# EAGLE design brainboard (EAGLE 5.11)

## Sheet 1 of 2
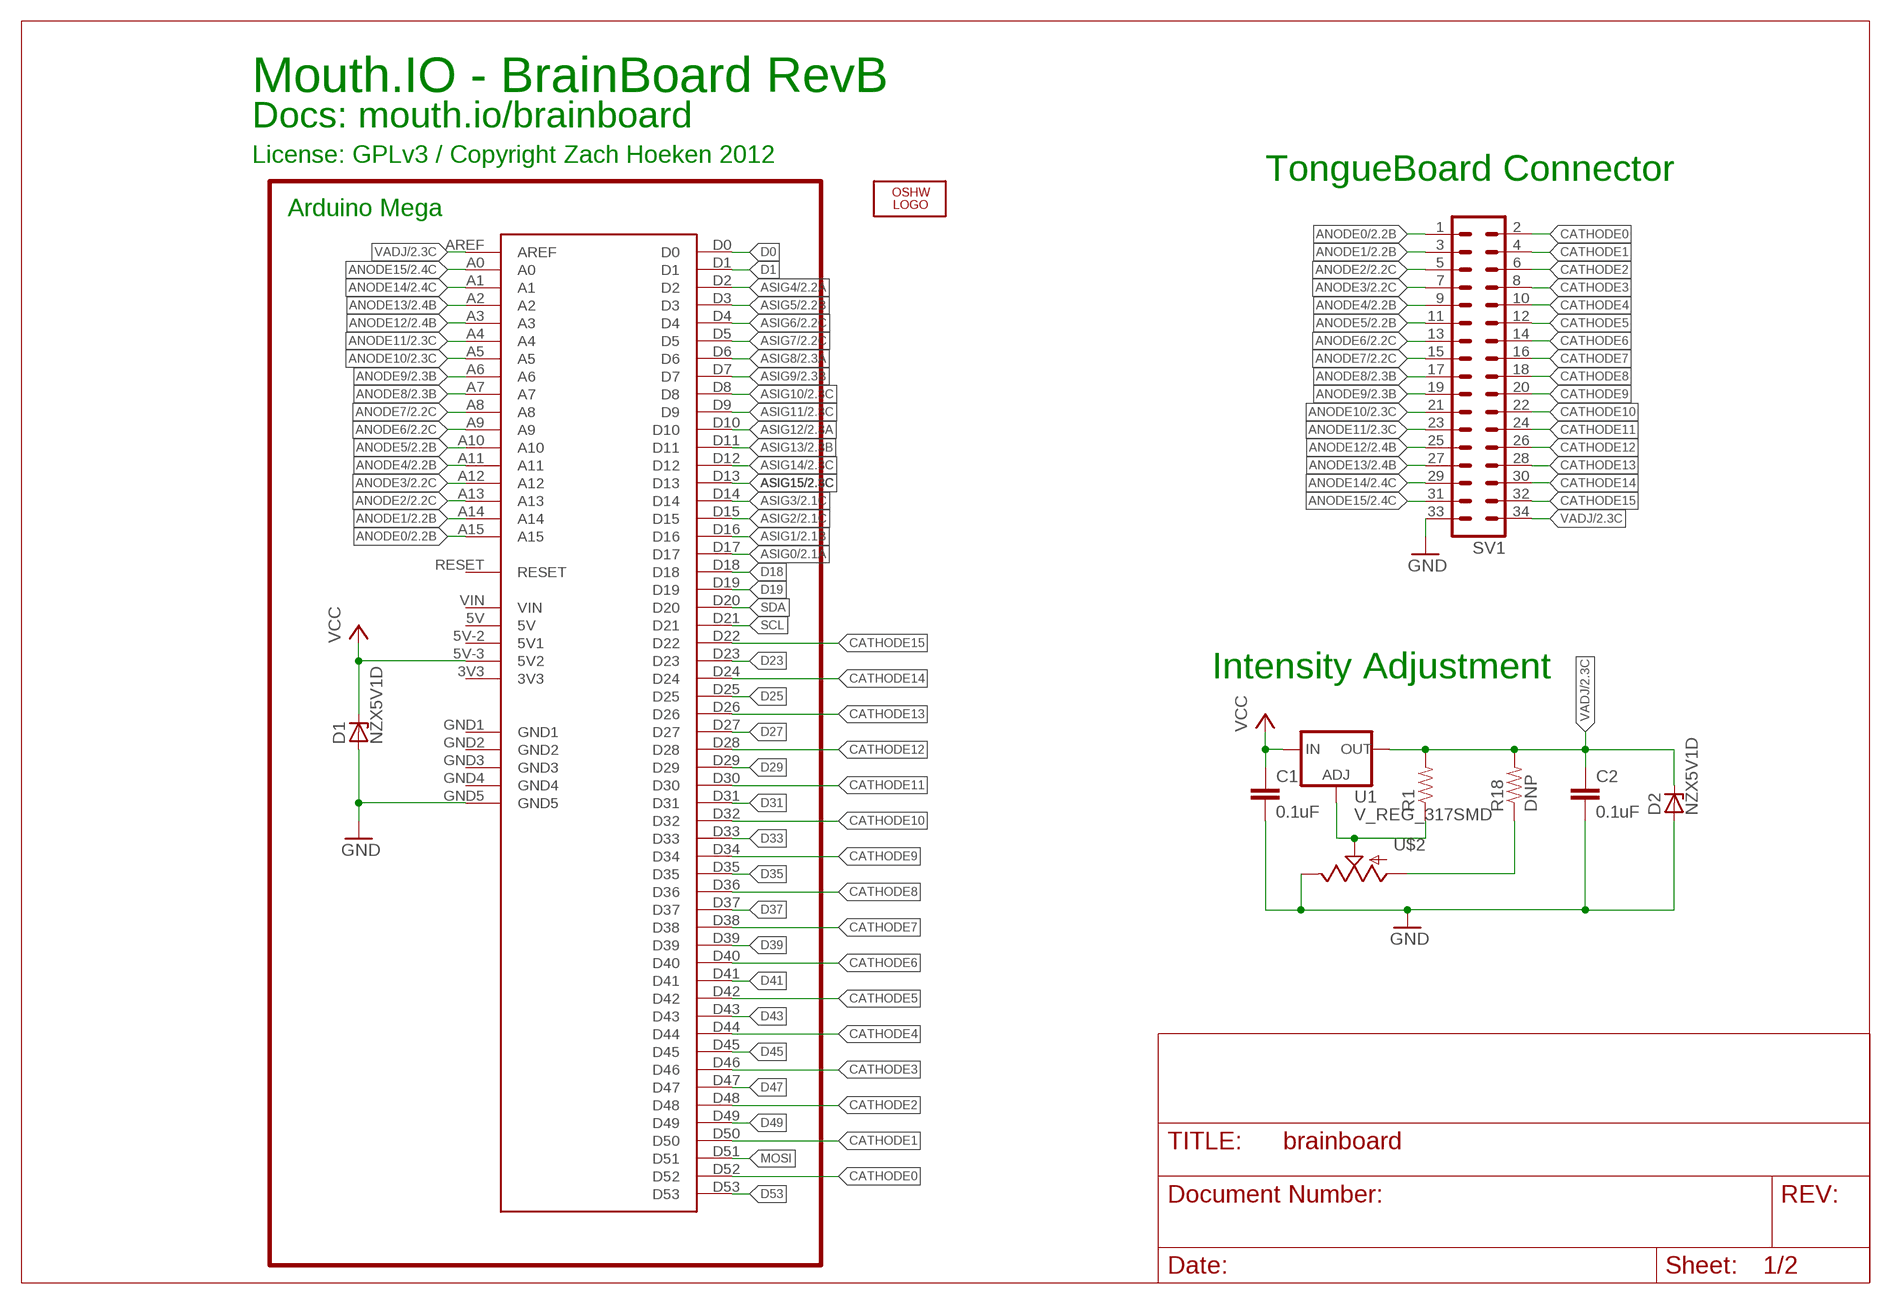
[diagram p0: schematic, sheet 1]

### Parts
C1  0.1uF  CAP0805  [0805]
C2  0.1uF  CAP0805  [0805]
D1  NZX5V1D  ZENER-DIODESOD80C  [SOD80C]
D2  NZX5V1D  ZENER-DIODESOD80C  [SOD80C]
LOGO1  OSHW_LOGO_10MILX0200-NT  [OSHW_10X200_NOTEXT]
R1  RESISTOR  [0805]
R18  DNP  RESISTOR  [0805]
SV1  ML34  [ML34]
U1  V_REG_317SMD  [SOT223]
U$1  ARDUINO-MEGA  [ARDUINO-MEGA]
U$2  POTPTV09A-4  [PTV09A-4]

### Nets
ANODE0: SV1.1 U$1.A15 ; also sheet 2
ANODE1: SV1.3 U$1.A14 ; also sheet 2
ANODE2: SV1.5 U$1.A13 ; also sheet 2
ANODE3: SV1.7 U$1.A12 ; also sheet 2
ANODE4: SV1.9 U$1.A11 ; also sheet 2
ANODE5: SV1.11 U$1.A10 ; also sheet 2
ANODE6: SV1.13 U$1.A9 ; also sheet 2
ANODE7: SV1.15 U$1.A8 ; also sheet 2
ANODE8: SV1.17 U$1.A7 ; also sheet 2
ANODE9: SV1.19 U$1.A6 ; also sheet 2
ANODE10: SV1.21 U$1.A5 ; also sheet 2
ANODE11: SV1.23 U$1.A4 ; also sheet 2
ANODE12: SV1.25 U$1.A3 ; also sheet 2
ANODE13: SV1.27 U$1.A2 ; also sheet 2
ANODE14: SV1.29 U$1.A1 ; also sheet 2
ANODE15: SV1.31 U$1.A0 ; also sheet 2
ASIG0: U$1.D17 ; also sheet 2
ASIG1: U$1.D16 ; also sheet 2
ASIG2: U$1.D15 ; also sheet 2
ASIG3: U$1.D14 ; also sheet 2
ASIG4: U$1.D2 ; also sheet 2
ASIG5: U$1.D3 ; also sheet 2
ASIG6: U$1.D4 ; also sheet 2
ASIG7: U$1.D5 ; also sheet 2
ASIG8: U$1.D6 ; also sheet 2
ASIG9: U$1.D7 ; also sheet 2
ASIG10: U$1.D8 ; also sheet 2
ASIG11: U$1.D9 ; also sheet 2
ASIG12: U$1.D10 ; also sheet 2
ASIG13: U$1.D11 ; also sheet 2
ASIG14: U$1.D12 ; also sheet 2
ASIG15: U$1.D13 ; also sheet 2
CATHODE0: SV1.2 U$1.D52
CATHODE1: SV1.4 U$1.D50
CATHODE2: SV1.6 U$1.D48
CATHODE3: SV1.8 U$1.D46
CATHODE4: SV1.10 U$1.D44
CATHODE5: SV1.12 U$1.D42
CATHODE6: SV1.14 U$1.D40
CATHODE7: SV1.16 U$1.D38
CATHODE8: SV1.18 U$1.D36
CATHODE9: SV1.20 U$1.D34
CATHODE10: SV1.22 U$1.D32
CATHODE11: SV1.24 U$1.D30
CATHODE12: SV1.26 U$1.D28
CATHODE13: SV1.28 U$1.D26
CATHODE14: SV1.30 U$1.D24
CATHODE15: SV1.32 U$1.D22
D0: U$1.D0
D1: U$1.D1
D18: U$1.D18
D19: U$1.D19
D23: U$1.D23
D25: U$1.D25
D27: U$1.D27
D29: U$1.D29
D31: U$1.D31
D33: U$1.D33
D35: U$1.D35
D37: U$1.D37
D39: U$1.D39
D41: U$1.D41
D43: U$1.D43
D45: U$1.D45
D47: U$1.D47
D49: U$1.D49
D53: U$1.D53
GND: C1.2 C2.2 D1.A D2.A SV1.33 U$1.GND5 U$2.1(E)
MOSI: U$1.D51
N$1: R18.1 U$2.3(A)
N$4: R1.1 U1.1(ADJ) U$2.2(S)
SCL: U$1.D21
SDA: U$1.D20
VADJ: C2.1 D2.C R1.2 R18.2 SV1.34 U1.2(OUT) U$1.AREF ; also sheet 2
VCC: C1.1 D1.C U1.3(IN) U$1.5V-3(5V2)
Unconnected: U$1.3V3 U$1.5V U$1.5V-2(5V1) U$1.GND1 U$1.GND2 U$1.GND3 U$1.GND4 U$1.RESET U$1.VIN

### Notes on the sheet
- Mouth.IO - BrainBoard RevB
- Docs: mouth.io/brainboard
- License: GPLv3 / Copyright Zach Hoeken 2012
- TongueBoard Connector
- Arduino Mega
- Intensity Adjustment

## Sheet 2 of 2
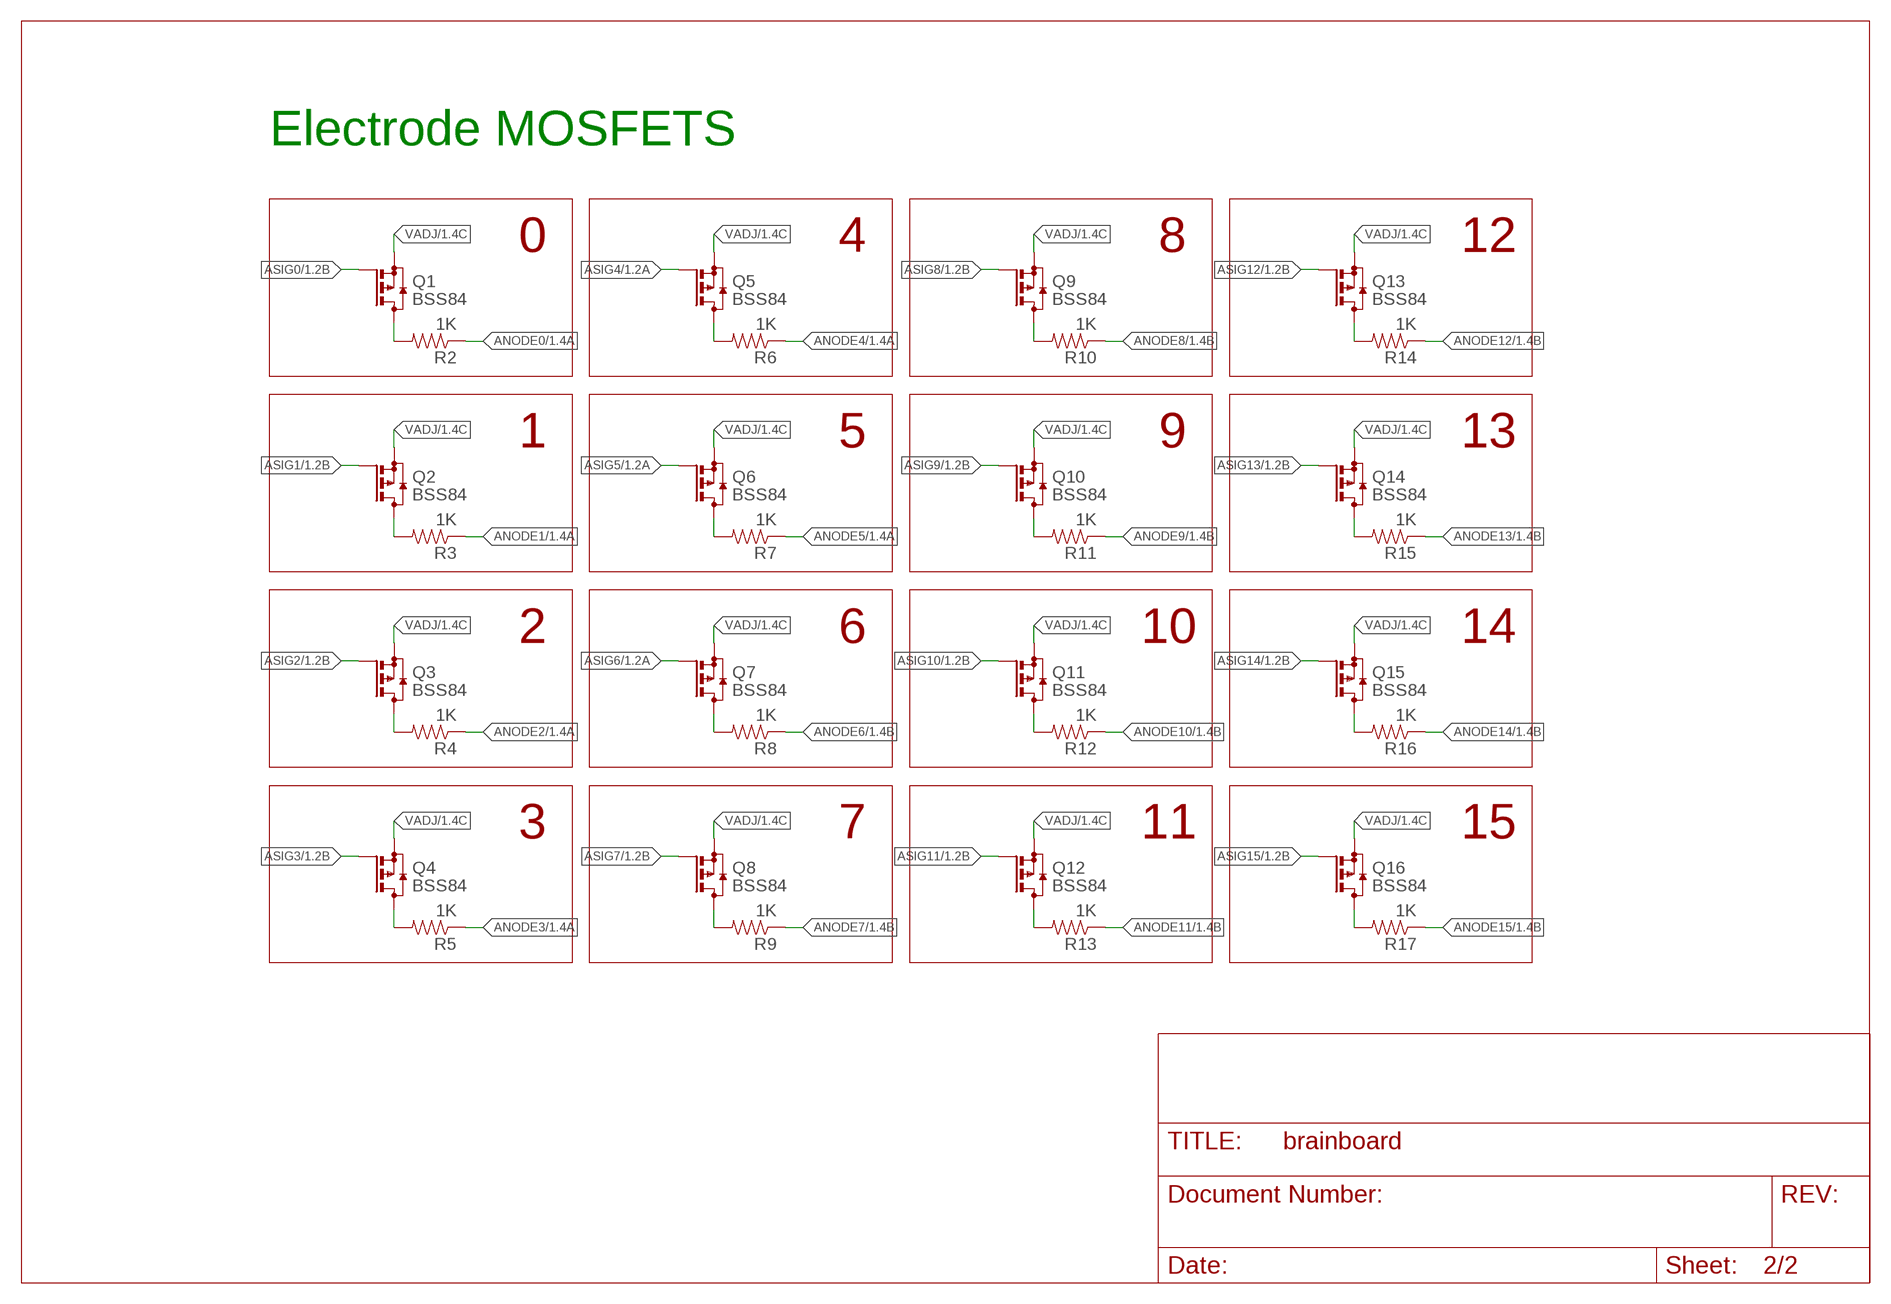
[diagram p1: schematic, sheet 2]

### Parts
Q1  BSS84  [SOT23]
Q2  BSS84  [SOT23]
Q3  BSS84  [SOT23]
Q4  BSS84  [SOT23]
Q5  BSS84  [SOT23]
Q6  BSS84  [SOT23]
Q7  BSS84  [SOT23]
Q8  BSS84  [SOT23]
Q9  BSS84  [SOT23]
Q10  BSS84  [SOT23]
Q11  BSS84  [SOT23]
Q12  BSS84  [SOT23]
Q13  BSS84  [SOT23]
Q14  BSS84  [SOT23]
Q15  BSS84  [SOT23]
Q16  BSS84  [SOT23]
R2  1K  RESISTOR  [0805]
R3  1K  RESISTOR  [0805]
R4  1K  RESISTOR  [0805]
R5  1K  RESISTOR  [0805]
R6  1K  RESISTOR  [0805]
R7  1K  RESISTOR  [0805]
R8  1K  RESISTOR  [0805]
R9  1K  RESISTOR  [0805]
R10  1K  RESISTOR  [0805]
R11  1K  RESISTOR  [0805]
R12  1K  RESISTOR  [0805]
R13  1K  RESISTOR  [0805]
R14  1K  RESISTOR  [0805]
R15  1K  RESISTOR  [0805]
R16  1K  RESISTOR  [0805]
R17  1K  RESISTOR  [0805]

### Nets
ANODE0: R2.1 ; also sheet 1
ANODE1: R3.1 ; also sheet 1
ANODE2: R4.1 ; also sheet 1
ANODE3: R5.1 ; also sheet 1
ANODE4: R6.1 ; also sheet 1
ANODE5: R7.1 ; also sheet 1
ANODE6: R8.1 ; also sheet 1
ANODE7: R9.1 ; also sheet 1
ANODE8: R10.1 ; also sheet 1
ANODE9: R11.1 ; also sheet 1
ANODE10: R12.1 ; also sheet 1
ANODE11: R13.1 ; also sheet 1
ANODE12: R14.1 ; also sheet 1
ANODE13: R15.1 ; also sheet 1
ANODE14: R16.1 ; also sheet 1
ANODE15: R17.1 ; also sheet 1
ASIG0: Q1.1(G) ; also sheet 1
ASIG1: Q2.1(G) ; also sheet 1
ASIG2: Q3.1(G) ; also sheet 1
ASIG3: Q4.1(G) ; also sheet 1
ASIG4: Q5.1(G) ; also sheet 1
ASIG5: Q6.1(G) ; also sheet 1
ASIG6: Q7.1(G) ; also sheet 1
ASIG7: Q8.1(G) ; also sheet 1
ASIG8: Q9.1(G) ; also sheet 1
ASIG9: Q10.1(G) ; also sheet 1
ASIG10: Q11.1(G) ; also sheet 1
ASIG11: Q12.1(G) ; also sheet 1
ASIG12: Q13.1(G) ; also sheet 1
ASIG13: Q14.1(G) ; also sheet 1
ASIG14: Q15.1(G) ; also sheet 1
ASIG15: Q16.1(G) ; also sheet 1
N$34: Q1.3(D) R2.2
N$35: Q2.3(D) R3.2
N$36: Q3.3(D) R4.2
N$37: Q4.3(D) R5.2
N$38: Q5.3(D) R6.2
N$39: Q6.3(D) R7.2
N$40: Q7.3(D) R8.2
N$41: Q8.3(D) R9.2
N$42: Q9.3(D) R10.2
N$43: Q10.3(D) R11.2
N$44: Q11.3(D) R12.2
N$45: Q12.3(D) R13.2
N$46: Q13.3(D) R14.2
N$47: Q14.3(D) R15.2
N$48: Q15.3(D) R16.2
N$49: Q16.3(D) R17.2
VADJ: Q1.2(S) Q2.2(S) Q3.2(S) Q4.2(S) Q5.2(S) Q6.2(S) Q7.2(S) Q8.2(S) Q9.2(S) Q10.2(S) Q11.2(S) Q12.2(S) Q13.2(S) Q14.2(S) Q15.2(S) Q16.2(S) ; also sheet 1

### Notes on the sheet
- Electrode MOSFETS
- 0 | 4 | 8 | 12
- 1 | 5 | 9 | 13
- 2 | 6 | 10 | 14
- 3 | 7 | 11 | 15

## Library data of the parts
C1 C2 = SparkFun:CAP: Capacitor Standard 0603 ceramic capacitor, and 0.1" leaded capacitor.
D1 D2 = diode:ZENER-DIODE: Z-Diode
LOGO1 = ohw-logo:OSHW_LOGO_10MIL
Q1-Q16 = transistor-small-signal:BSS84: P-CHANNEL MOS FET
R1-R18 = SparkFun:RESISTOR: Resistor Basic schematic elements and footprints for 0603, 1206, and PTH 1/10th watt (small) resistors.
SV1 = con-ml:ML34: HARTING
U1 = SparkFun:V_REG_317: Voltage Regulator Standard LM317 adjustable voltage regulator. AOI (Adjust Output Input). Google 'LM317 Calculator' for easy to use app to get the two resistor values needed. 240/720 for 5V output. 240/390 for 3.3V output. Spark Fun Electronics SKU : COM-00527
U$1 = MakerBot:ARDUINO-MEGA
U$2 = Hoeken:POT

## Net classes
0 default: width 0.254 mm, drill 0.508 mm, clearance 0.254 mm
1 power: width 0.61 mm, drill 0.711 mm, clearance 0.203 mm
2 gnd: width 0.305 mm, drill 0.711 mm, clearance 0.203 mm
3 usbvcc: width 0.508 mm, drill 0.711 mm, clearance 0.203 mm

## Board
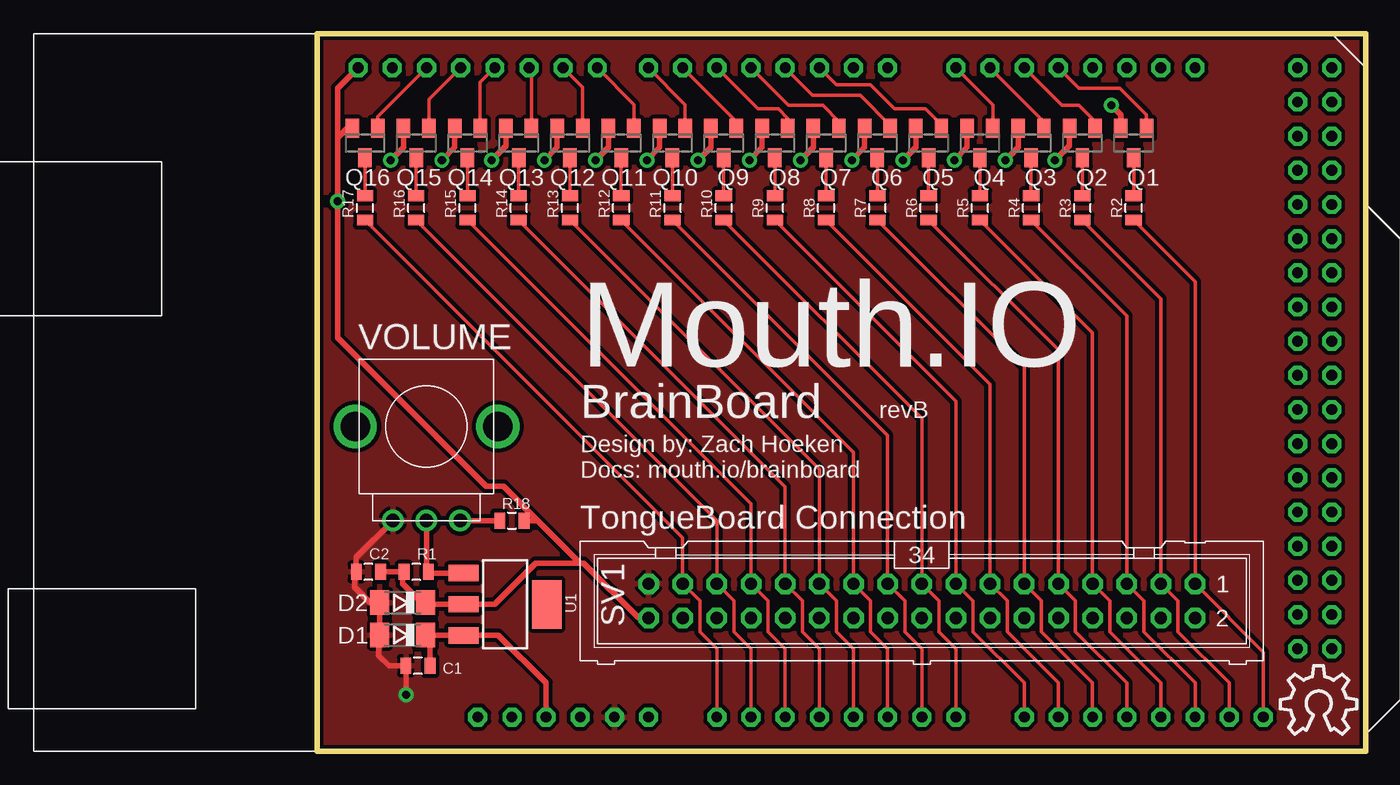
[diagram p2: board, top side]
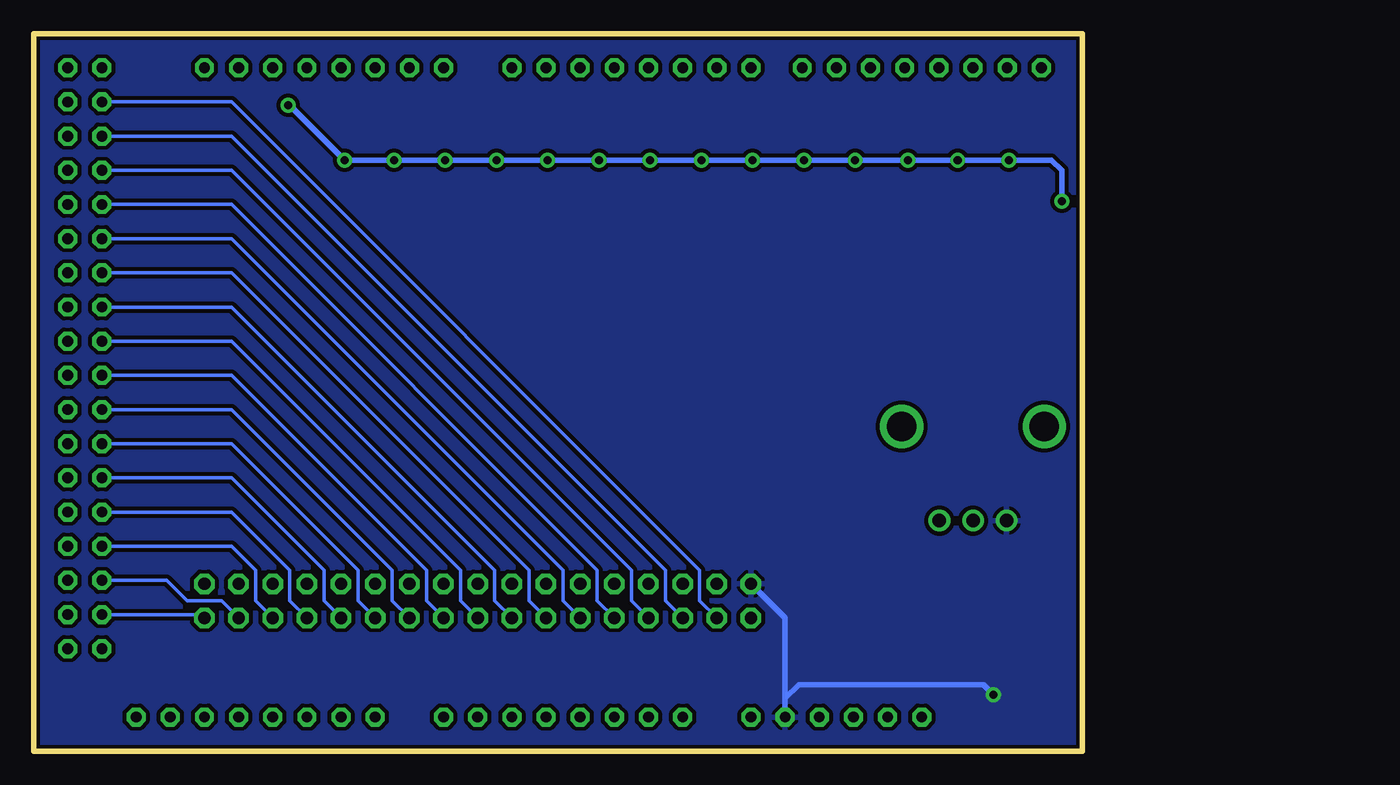
[diagram p3: board, bottom side, seen from below]

Size 77.98 x 53.34 mm. Coordinates in mm from the lower left corner, seen from the top.
Outline: 0,0 77.98,0 77.98,53.34 0,53.34 0,0
Copper layers (1*16): Top 0.035mm / dielectric 1.5mm / Bottom 0.035mm
Design rules "SparkFun *": minimum track width 8mil, minimum drill 20mil, track to track 12mil, track to pad 12mil, pad to pad 12mil, via to via 12mil, smd to smd 12mil, copper to edge 10mil, drill to drill 8mil, minimum pad ring 12mil, minimum via ring 10mil, stop-mask expansion 4mil, vias tented up to drill 25mil, thermal gap 10mil

### Footprints (pad centres in the part's own frame; a part is rotated, then mirrored left to right if it is on the bottom)
0805 = smd 0.8 x 1.2: 1 -0.9,0; 2 0.9,0
SOD80C = smd 1.4 x 1.8: A 1.7,0; C -1.7,0
SOT23 = smd 1 x 1.4: 1 -0.95,-1.1; 2 0.95,-1.1; 3 0,1.1
ML34 = drill 0.914 octagon: 1 -20.32,-1.27; 2 -20.32,1.27; 3 -17.78,-1.27; 4 -17.78,1.27; 5 -15.24,-1.27; 6 -15.24,1.27; 7 -12.7,-1.27; 8 -12.7,1.27; 9 -10.16,-1.27; 10 -10.16,1.27; 11 -7.62,-1.27; 12 -7.62,1.27; 13 -5.08,-1.27; 14 -5.08,1.27; 15 -2.54,-1.27; 16 -2.54,1.27; 17 0,-1.27; 18 0,1.27; 19 2.54,-1.27; 20 2.54,1.27; 21 5.08,-1.27; 22 5.08,1.27; 23 7.62,-1.27; 24 7.62,1.27; 25 10.16,-1.27; 26 10.16,1.27; 27 12.7,-1.27; 28 12.7,1.27; 29 15.24,-1.27; 30 15.24,1.27; 31 17.78,-1.27; 32 17.78,1.27; 33 20.32,-1.27; 34 20.32,1.27
SOT223 = smd 1.219 x 2.235: 1 -2.311,-3.099; 2 0,-3.099; 3 2.311,-3.099 | smd 3.6 x 2.2: 4 0,3.099
ARDUINO-MEGA = drill 0.8 octagon: 3V3 35.56,2.54; 5V 93.98,50.8; 5V-2 96.52,50.8; 5V-3 38.1,2.54; A0 50.8,2.54; A1 53.34,2.54; A2 55.88,2.54; A3 58.42,2.54; A4 60.96,2.54; A5 63.5,2.54; A6 66.04,2.54; A7 68.58,2.54; A8 73.66,2.54; A9 76.2,2.54; A10 78.74,2.54; A11 81.28,2.54; A12 83.82,2.54; A13 86.36,2.54; A14 88.9,2.54; A15 91.44,2.54; AREF 24.13,50.8; D0 63.5,50.8; D1 60.96,50.8; D2 58.42,50.8; D3 55.88,50.8; D4 53.34,50.8; D5 50.8,50.8; D6 48.26,50.8; D7 45.72,50.8; D8 41.91,50.8; D9 39.37,50.8; D10 36.83,50.8; D11 34.29,50.8; D12 31.75,50.8; D13 29.21,50.8; D14 68.58,50.8; D15 71.12,50.8; D16 73.66,50.8; D17 76.2,50.8; D18 78.74,50.8; D19 81.28,50.8; D20 83.82,50.8; D21 86.36,50.8; D22 93.98,48.26; D23 96.52,48.26; D24 93.98,45.72; D25 96.52,45.72; D26 93.98,43.18; D27 96.52,43.18; D28 93.98,40.64; D29 96.52,40.64; D30 93.98,38.1; D31 96.52,38.1; D32 93.98,35.56; D33 96.52,35.56; D34 93.98,33.02; D35 96.52,33.02; D36 93.98,30.48; D37 96.52,30.48; D38 93.98,27.94; D39 96.52,27.94; D40 93.98,25.4; D41 96.52,25.4; D42 93.98,22.86; D43 96.52,22.86; D44 93.98,20.32; D45 96.52,20.32; D46 93.98,17.78; D47 96.52,17.78; D48 93.98,15.24; D49 96.52,15.24; D50 93.98,12.7; D51 96.52,12.7; D52 93.98,10.16; D53 96.52,10.16; GND1 26.67,50.8; GND2 93.98,7.62; GND3 96.52,7.62; GND4 40.64,2.54; GND5 43.18,2.54; RESET 33.02,2.54; VIN 45.72,2.54
PTV09A-4 = drill 1 round: 1 -2.5,0; 2 0,0; 3 2.5,0 | drill 2.2 round: P$4 5.3,7; P$5 -5.3,7

### Placement (x,y rotation side)
C1  7.49,6.35 180 top
C2  3.81,13.34 180 top
D1  6.35,8.64 180 top
D2  6.35,11.05 180 top
LOGO1  71.63,1.27 0 top
Q1  60.71,45.21 180 top
Q2  56.9,45.21 180 top
Q3  53.09,45.21 180 top
Q4  49.28,45.21 180 top
Q5  45.47,45.21 180 top
Q6  41.66,45.21 180 top
Q7  37.85,45.21 180 top
Q8  34.04,45.21 180 top
Q9  30.23,45.21 180 top
Q10  26.42,45.21 180 top
Q11  22.61,45.21 180 top
Q12  18.8,45.21 180 top
Q13  14.99,45.21 180 top
Q14  11.18,45.21 180 top
Q15  7.37,45.21 180 top
Q16  3.56,45.21 180 top
R1  7.37,13.34 180 top
R2  60.71,40.39 90 top
R3  56.9,40.39 90 top
R4  53.09,40.39 90 top
R5  49.28,40.39 90 top
R6  45.47,40.39 90 top
R7  41.66,40.39 90 top
R8  37.85,40.39 90 top
R9  34.04,40.39 90 top
R10  30.23,40.39 90 top
R11  26.42,40.39 90 top
R12  22.61,40.39 90 top
R13  18.8,40.39 90 top
R14  14.99,40.39 90 top
R15  11.18,40.39 90 top
R16  7.37,40.39 90 top
R17  3.56,40.39 90 top
R18  14.48,17.14 0 top
SV1  44.96,11.18 180 top
U1  13.97,10.92 270 top
U$1  -21.08,0 0 top
U$2  8.13,17.14 0 top

### Tracks (layer width: path | path; a pad name or v marks a point on that pad's centre or on a via)
ANODE0
  Top 0.254: R2.1 65.28,34.91 SV1.1 70.36,7.37 U$1.A15
ANODE1
  Top 0.254: R3.1 62.74,33.64 SV1.3 64.01,11.18 64.01,8.89 67.82,5.08 U$1.A14
ANODE2
  Top 0.254: R4.1 60.2,32.37 SV1.5 61.47,11.18 61.47,8.89 65.28,5.08 U$1.A13
ANODE3
  Top 0.254: R5.1 57.66,31.1 SV1.7 58.93,11.18 58.93,8.89 62.74,5.08 U$1.A12
ANODE4
  Top 0.254: R6.1 55.12,29.83 SV1.9 56.39,11.18 56.39,8.89 60.2,5.08 U$1.A11
ANODE5
  Top 0.254: R7.1 52.58,28.56 SV1.11 53.85,11.18 53.85,8.89 57.66,5.08 U$1.A10
ANODE6
  Top 0.254: R8.1 50.04,27.29 SV1.13 51.31,11.18 51.31,8.89 55.12,5.08 U$1.A9
ANODE7
  Top 0.254: R9.1 47.5,26.02 SV1.15 48.77,11.18 48.77,8.89 52.58,5.08 U$1.A8
ANODE8
  Top 0.254: R10.1 44.96,24.75 SV1.17 46.23,11.18 46.23,8.89 47.5,7.62 U$1.A7
ANODE9
  Top 0.254: R11.1 42.42,23.48 SV1.19 43.69,11.18 43.69,8.89 44.96,7.62 U$1.A6
ANODE10
  Top 0.254: R12.1 39.88,22.21 SV1.21 41.15,11.18 41.15,8.89 42.42,7.62 U$1.A5
ANODE11
  Top 0.254: R13.1 37.34,20.94 SV1.23 38.61,11.18 38.61,8.89 39.88,7.62 U$1.A4
ANODE12
  Top 0.254: R14.1 34.8,19.67 SV1.25 36.07,11.18 36.07,8.89 37.34,7.62 U$1.A3
ANODE13
  Top 0.254: R15.1 32.26,18.4 SV1.27 33.53,11.18 33.53,8.89 34.8,7.62 U$1.A2
ANODE14
  Top 0.254: R16.1 29.72,17.13 SV1.29 30.99,11.18 30.99,8.89 32.26,7.62 U$1.A1
ANODE15
  Top 0.254: R17.1 27.18,15.86 SV1.31 28.45,11.18 28.45,8.89 29.72,7.62 U$1.A0
ASIG0
  Top 0.254: Q1.1 61.66,47.31 59.69,49.28 56.64,49.28 U$1.D17
ASIG1
  Top 0.254: Q2.1 57.85,46.8 56.64,48.01 55.37,48.01 U$1.D16
ASIG2
  Top 0.254: Q3.1 54.04,46.8 U$1.D15
ASIG3
  Top 0.254: Q4.1 50.23,48.07 U$1.D14
ASIG4
  Top 0.254: U$1.D2 38.61,49.53 41.15,49.53 42.93,47.75 45.21,47.75 46.48,46.48 46.48,46.38 Q5.1
ASIG5
  Top 0.254: Q6.1 42.61,46.55 40.39,48.77 36.83,48.77 U$1.D3
ASIG6
  Top 0.254: Q7.1 38.8,46.8 37.59,48.01 35.05,48.01 U$1.D4
ASIG7
  Top 0.254: Q8.1 34.99,47.06 34.29,47.75 32.77,47.75 U$1.D5
ASIG8
  Top 0.254: Q9.1 31.18,46.8 U$1.D6
ASIG9
  Top 0.254: Q10.1 27.37,48.07 U$1.D7
ASIG10
  Top 0.254: Q11.1 23.56,48.07 U$1.D8
ASIG11
  Top 0.254: Q12.1 19.75,49.34 U$1.D9
ASIG12
  Top 0.254: Q13.1 15.94,50.61 U$1.D10
ASIG13
  Top 0.254: Q14.1 12.13,49.72 U$1.D11
ASIG14
  Top 0.254: Q15.1 8.32,48.45 U$1.D12
ASIG15
  Top 0.254: Q16.1 4.51,47.18 U$1.D13
CATHODE0
  Bottom 0.254: U$1.D52 65.53,10.16 SV1.2
CATHODE1
  Bottom 0.254: U$1.D50 68.07,12.7 66.55,11.18 64.01,11.18 SV1.4
CATHODE2
  Bottom 0.254: U$1.D48 63.25,15.24 61.47,13.46 61.47,11.18 SV1.6
CATHODE3
  Bottom 0.254: U$1.D46 63.25,17.78 58.93,13.46 58.93,11.18 SV1.8
CATHODE4
  Bottom 0.254: U$1.D44 63.25,20.32 56.39,13.46 56.39,11.18 SV1.10
CATHODE5
  Bottom 0.254: U$1.D42 63.25,22.86 53.85,13.46 53.85,11.18 SV1.12
CATHODE6
  Bottom 0.254: U$1.D40 63.25,25.4 51.31,13.46 51.31,11.18 SV1.14
CATHODE7
  Bottom 0.254: U$1.D38 63.25,27.94 48.77,13.46 48.77,11.18 SV1.16
CATHODE8
  Bottom 0.254: U$1.D36 63.25,30.48 46.23,13.46 46.23,11.18 SV1.18
CATHODE9
  Bottom 0.254: U$1.D34 63.25,33.02 43.69,13.46 43.69,11.18 SV1.20
CATHODE10
  Bottom 0.254: U$1.D32 63.25,35.56 41.15,13.46 41.15,11.18 SV1.22
CATHODE11
  Bottom 0.254: U$1.D30 63.25,38.1 38.61,13.46 38.61,11.18 SV1.24
CATHODE12
  Bottom 0.254: U$1.D28 63.25,40.64 36.07,13.46 36.07,11.18 SV1.26
CATHODE13
  Bottom 0.254: U$1.D26 63.25,43.18 33.53,13.46 33.53,11.18 SV1.28
CATHODE14
  Bottom 0.254: U$1.D24 63.25,45.72 30.99,13.46 30.99,11.18 SV1.30
CATHODE15
  Bottom 0.254: U$1.D22 63.25,48.26 28.45,13.46 28.45,11.18 SV1.32
GND  (via drill 0.6)
  Top 0.406: U$2.1 2.91,14.43 C2.2 2.79,13.22 2.79,12.19 3.94,11.05 D2.A D1.A 4.57,8.56 4.57,7.11 5.33,6.35 C1.2 v6.6,4.19
  Bottom 0.406: SV1.33 22.1,9.91 U$1.GND5 22.1,3.94 21.08,4.95 7.37,4.95 v6.6,4.19
  pour Bottom: -0.76,55.88 80.52,55.88 80.52,-2.54 -0.76,-2.54
  pour Top: -0.76,55.88 80.52,55.88 80.52,-2.54 -0.76,-2.54
N$1
  Top 0.406: U$2.3 R18.1
N$2
  Top 0: -21.08,0 arc11 -21.08,0 | -21.08,0 | -21.08,0 arc19 -21.08,0 | -21.08,0 | -21.08,0 | -21.08,0 | -21.08,0 arc19 -21.08,0 | -21.08,0 | -21.08,0 arc19 -21.08,0 | -21.08,0 | -21.08,0 | -21.08,0 | -21.08,0 arc-19 -21.08,0 | -21.08,0 -21.09,0 -21.08,0 | -21.08,0 arc-19 -21.08,0 | -21.09,0 -21.08,0 | -21.09,0 | -21.08,0 -21.09,0 | -21.08,0 arc-19 -21.08,0 | -21.08,0 -21.09,0 -21.08,0 | -21.08,0 arc-11 -21.08,0 | -21.08,0 | -21.08,0 arc-65 -21.08,0 arc-245 -21.08,0 | -21.08,0
N$4
  Top 0.406: U1.1 8.37,13.23 R1.1 8.13,13.47 U$2.2
N$34
  Top 0.254: R2.2 Q1.3
N$35
  Top 0.254: R3.2 Q2.3
N$36
  Top 0.254: R4.2 Q3.3
N$37
  Top 0.254: R5.2 Q4.3
N$38
  Top 0.254: R6.2 Q5.3
N$39
  Top 0.254: R7.2 Q6.3
N$40
  Top 0.254: R8.2 Q7.3
N$41
  Top 0.254: R9.2 Q8.3
N$42
  Top 0.254: R10.2 Q9.3
N$43
  Top 0.254: R11.2 Q10.3
N$44
  Top 0.254: R12.2 Q11.3
N$45
  Top 0.254: R13.2 Q12.3
N$46
  Top 0.254: R14.2 Q13.3
N$47
  Top 0.254: R15.2 Q14.3
N$48
  Top 0.254: R16.2 Q15.3
N$49
  Top 0.254: R17.2 Q16.3
VADJ  (via drill 0.6)
  Top 0.406: C2.1 R1.2 6.35,13.22 6.35,12.45 7.75,11.05 D2.C 8.18,10.92 U1.2 13.21,10.92 16.26,13.97 19.56,13.97 | SV1.34 23.88,9.91 19.81,13.97 19.56,13.97 | v1.52,40.89 1.52,41.15 | Q16.2 2.61,46.29 2.22,46.29 1.52,45.59 | Q15.2 6.42,44.9 v5.46,43.94 | Q14.2 10.23,44.9 v9.27,43.94 | Q13.2 14.04,45.02 v12.95,43.94 | Q12.2 17.85,44.9 v16.89,43.94 | Q11.2 21.66,44.9 v20.7,43.94 | Q10.2 25.47,44.9 v24.51,43.94 | Q9.2 29.28,44.9 v28.32,43.94 | Q8.2 33.09,44.9 v32.13,43.94 | Q7.2 36.9,44.9 v35.94,43.94 | Q6.2 40.71,44.9 v39.75,43.94 | Q5.2 44.52,44.9 v43.56,43.94 | Q4.2 48.33,44.9 v47.37,43.94 | Q3.2 52.14,44.9 v51.18,43.94 | Q2.2 55.95,45.02 v54.86,43.94 | Q1.2 59.76,47.3 v59.05,48.01 | v1.52,40.89 1.52,45.59 | 1.52,45.59 1.52,49.28 U$1.AREF | v1.52,40.89 1.52,30.73 12.57,19.68 13.84,19.68 16.38,17.14 | 16.38,17.14 R18.2 | 19.56,13.97 16.38,17.14
  Bottom 0.406: v1.52,40.89 1.52,43.18 2.29,43.94 v5.46,43.94 v9.27,43.94 v12.95,43.94 v16.89,43.94 v20.7,43.94 v24.51,43.94 v28.32,43.94 v32.13,43.94 v35.94,43.94 v39.75,43.94 v43.56,43.94 v47.37,43.94 v51.18,43.94 v54.86,43.94 | v54.86,43.94 55.12,43.69 | v59.05,48.01 58.93,48.01 v54.86,43.94
VCC
  Top 0.406: 10.85,8.64 D1.C 8.39,8.29 C1.1 | 10.85,8.64 U1.3 | U$1.5V-3 17.02,5.08 13.46,8.64 10.85,8.64

### Text on the board
tPlace: VOLUME | Mouth.IO | BrainBoard | revB | Design by: Zach Hoeken | Docs: mouth.io/brainboard | TongueBoard Connection